# Altium schematic sheet Board to Board Connectors.SchDoc: BOARD TO BOARD CONNECTORS
size A3
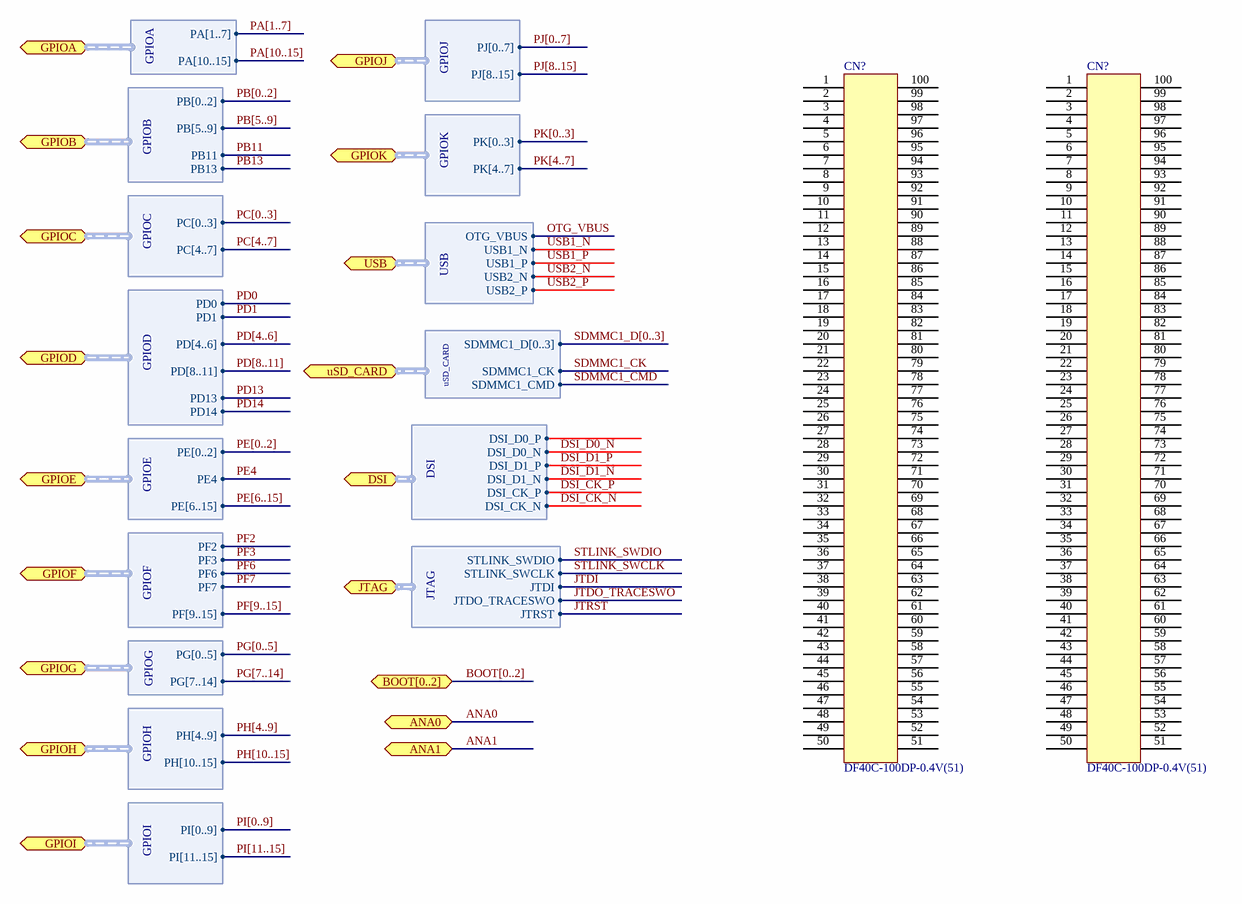
[diagram p0: Board to Board Connectors.SchDoc]

## Parts
(Parts that share a designator on the sheet are numbered #1, #2 ... from top to bottom, then left to right.)
CN?#1  DF40C-100DP-0.4V(51)
CN?#2  DF40C-100DP-0.4V(51)

## Ports
ANA0 (bidir), ANA1 (bidir), BOOT[0..2] (bidir), DSI (bidir, harness DSI), GPIOA (bidir, harness GPIOA), GPIOB (bidir, harness GPIOB), GPIOC (bidir, harness GPIOC), GPIOD (bidir, harness GPIOD), GPIOE (bidir, harness GPIOE), GPIOF (bidir, harness GPIOF), GPIOG (bidir, harness GPIOG), GPIOH (bidir, harness GPIOH), GPIOI (bidir, harness GPIOI), GPIOJ (bidir, harness GPIOJ), GPIOK (bidir, harness GPIOK), JTAG (bidir, harness JTAG), USB (bidir, harness USB), uSD_CARD (bidir, harness uSD_CARD)

## Harnesses
GPIOF: PF2, PF3, PF6, PF7, PF[9..15]
uSD_CARD: SDMMC1_CMD, SDMMC1_D[0..3], SDMMC1_CK
GPIOA: PA[1..7], PA[10..15]
GPIOB: PB[0..2], PB[5..9], PB11, PB13
GPIOD: PD0, PD1, PD[4..6], PD[8..11], PD13, PD14
GPIOE: PE[0..2], PE4, PE[6..15]
GPIOG: PG[0..5], PG[7..14]
GPIOK: PK[0..3], PK[4..7]
GPIOJ: PJ[0..7], PJ[8..15]
GPIOH: PH[4..9], PH[10..15]
GPIOI: PI[0..9], PI[11..15]
GPIOC: PC[0..3], PC[4..7]
DSI: DSI_D0_P, DSI_D0_N, DSI_D1_P, DSI_D1_N, DSI_CK_P, DSI_CK_N
JTAG: STLINK_SWDIO, STLINK_SWCLK, JTDI, JTDO_TRACESWO, JTRST
USB: OTG_VBUS, USB1_N, USB1_P, USB2_N, USB2_P

## Nets
ANA0: port ANA0
ANA1: port ANA1
DSI_CK_N: port DSI.DSI_CK_N
DSI_CK_P: port DSI.DSI_CK_P
DSI_D0_N: port DSI.DSI_D0_N
DSI_D1_N: port DSI.DSI_D1_N
DSI_D1_P: port DSI.DSI_D1_P
JTDI: port JTAG.JTDI
JTDO_TRACESWO: port JTAG.JTDO_TRACESWO
JTRST: port JTAG.JTRST
OTG_VBUS: port USB.OTG_VBUS
PB11: port GPIOB.PB11
PB13: port GPIOB.PB13
PD0: port GPIOD.PD0
PD1: port GPIOD.PD1
PD13: port GPIOD.PD13
PD14: port GPIOD.PD14
PE4: port GPIOE.PE4
PF2: port GPIOF.PF2
PF3: port GPIOF.PF3
PF6: port GPIOF.PF6
PF7: port GPIOF.PF7
SDMMC1_CK: port uSD_CARD.SDMMC1_CK
SDMMC1_CMD: port uSD_CARD.SDMMC1_CMD
STLINK_SWCLK: port JTAG.STLINK_SWCLK
STLINK_SWDIO: port JTAG.STLINK_SWDIO
USB1_N: port USB.USB1_N
USB1_P: port USB.USB1_P
USB2_N: port USB.USB2_N
USB2_P: port USB.USB2_P

Not connected (* = marked no-connect by the designer): CN?#1 1 2 3 4 5 6 7 8 9 10 11 12 13 14 15 16 17 18 19 20 21 22 23 24 25 26 27 28 29 30 31 32 33 34 35 36 37 38 39 40 41 42 43 44 45 46 47 48 49 50 51 52 53 54 55 56 57 58 59 60 61 62 63 64 65 66 67 68 69 70 71 72 73 74 75 76 77 78 79 80 81 82 83 84 85 86 87 88 89 90 91 92 93 94 95 96 97 98 99 100; CN?#2 1 2 3 4 5 6 7 8 9 10 11 12 13 14 15 16 17 18 19 20 21 22 23 24 25 26 27 28 29 30 31 32 33 34 35 36 37 38 39 40 41 42 43 44 45 46 47 48 49 50 51 52 53 54 55 56 57 58 59 60 61 62 63 64 65 66 67 68 69 70 71 72 73 74 75 76 77 78 79 80 81 82 83 84 85 86 87 88 89 90 91 92 93 94 95 96 97 98 99 100

## Buses and harness runs
bus BOOT[0..2] = port BOOT[0..2]
bus PA[1..7]
bus PA[10..15]
bus PB[0..2]
bus PB[5..9]
bus PC[0..3]
bus PC[4..7]
bus PD[4..6]
bus PD[8..11]
bus PE[0..2]
bus PE[6..15]
bus PF[9..15]
bus PG[0..5]
bus PG[7..14]
bus PH[4..9]
bus PH[10..15]
bus PI[0..9]
bus PI[11..15]
bus PJ[0..7]
bus PJ[8..15]
bus PK[0..3]
bus PK[4..7]
bus SDMMC1_D[0..3]

## Notes on the sheet
- Title
- Size:
- Date:
- A3
- Revision:
- Project Name:
- Sheet:
- of
- Drawn By:
- Checked By:
- www.logicboards.org

## Library data of the parts
CN?#1 CN?#2 = DF40C-100DP-0.4V(51): HIROSE(HRS) - DF40C-100DP-0.4V(51) - Stacking Board Connector, DF40 Series, Header, 0.4 mm, 100, Surface Mount, Gold Plated Contacts RoHS Compliant: Yes; Number of Contacts: 100; Voltage Rating: 30V; Current Rating: 300mA; Contact Resistance: 90mR; Connector Type: Plug; Gender: Male; Pitch: 0.4mm; Stack Height: 1.5mm; Mated Stacking Heights: 4mm; Supplier 1: Mouser; Manufacturer 1: Hirose; Manufacturer Part Number 1: DF40C-100DP-0.4V(51); RoHS: Yes; Category: Headers and Wire Housings; Pricing 1: 1=1.59000, 10=1.33000, 50=1.33000, 100=1.24000, 1000=0.88500, 10000=0.76700 (USD); Mount: Surface Mount; Contact Plating: Gold; Contact Material: Bronze; Housing Color: Black; Housing Material: Polymer; Min Operating Temperature: -35°C; Max Operating Temperature: 85°C; Number of Rows: 2; Termination: SMD/SMT; Package Quantity: 1; Packaging: Tape and Reel; Max Current Rating: 300mA; Number of Positions: 100; Max Voltage Rating (AC): 30V; Orientation: Straight; Series: DF40; Length: 21.52mm; Depth: 1.85mm; Radiation Hardening: No; REACH SVHC: Unknown; Lead Free: Lead Free; RoHS Compliant: Yes; ComponentLink1URL: https://datasheet.ciiva.com/26948/getdatasheetpartid-434445-26948932.pdf?src-supplier=Verical; ComponentLink1Description: https://datasheet.ciiva.com/26948/getdatasheetpartid-434445-26948932.pdf?src-supplier=Verical; ComponentLink2URL: https://datasheet.ciiva.com/46408/1824826-46408893.pdf?src-supplier=Element14; ComponentLink2Description: https://datasheet.ciiva.com/46408/1824826-46408893.pdf?src-supplier=Element14; Supplier 2: Digi-Key; Supplier Part Number 2: H11614CT-ND; Supplier Part Number 1: 798-DF40C100DP0.4V51